# EAGLE schematic curtains (EAGLE 9.6.2)
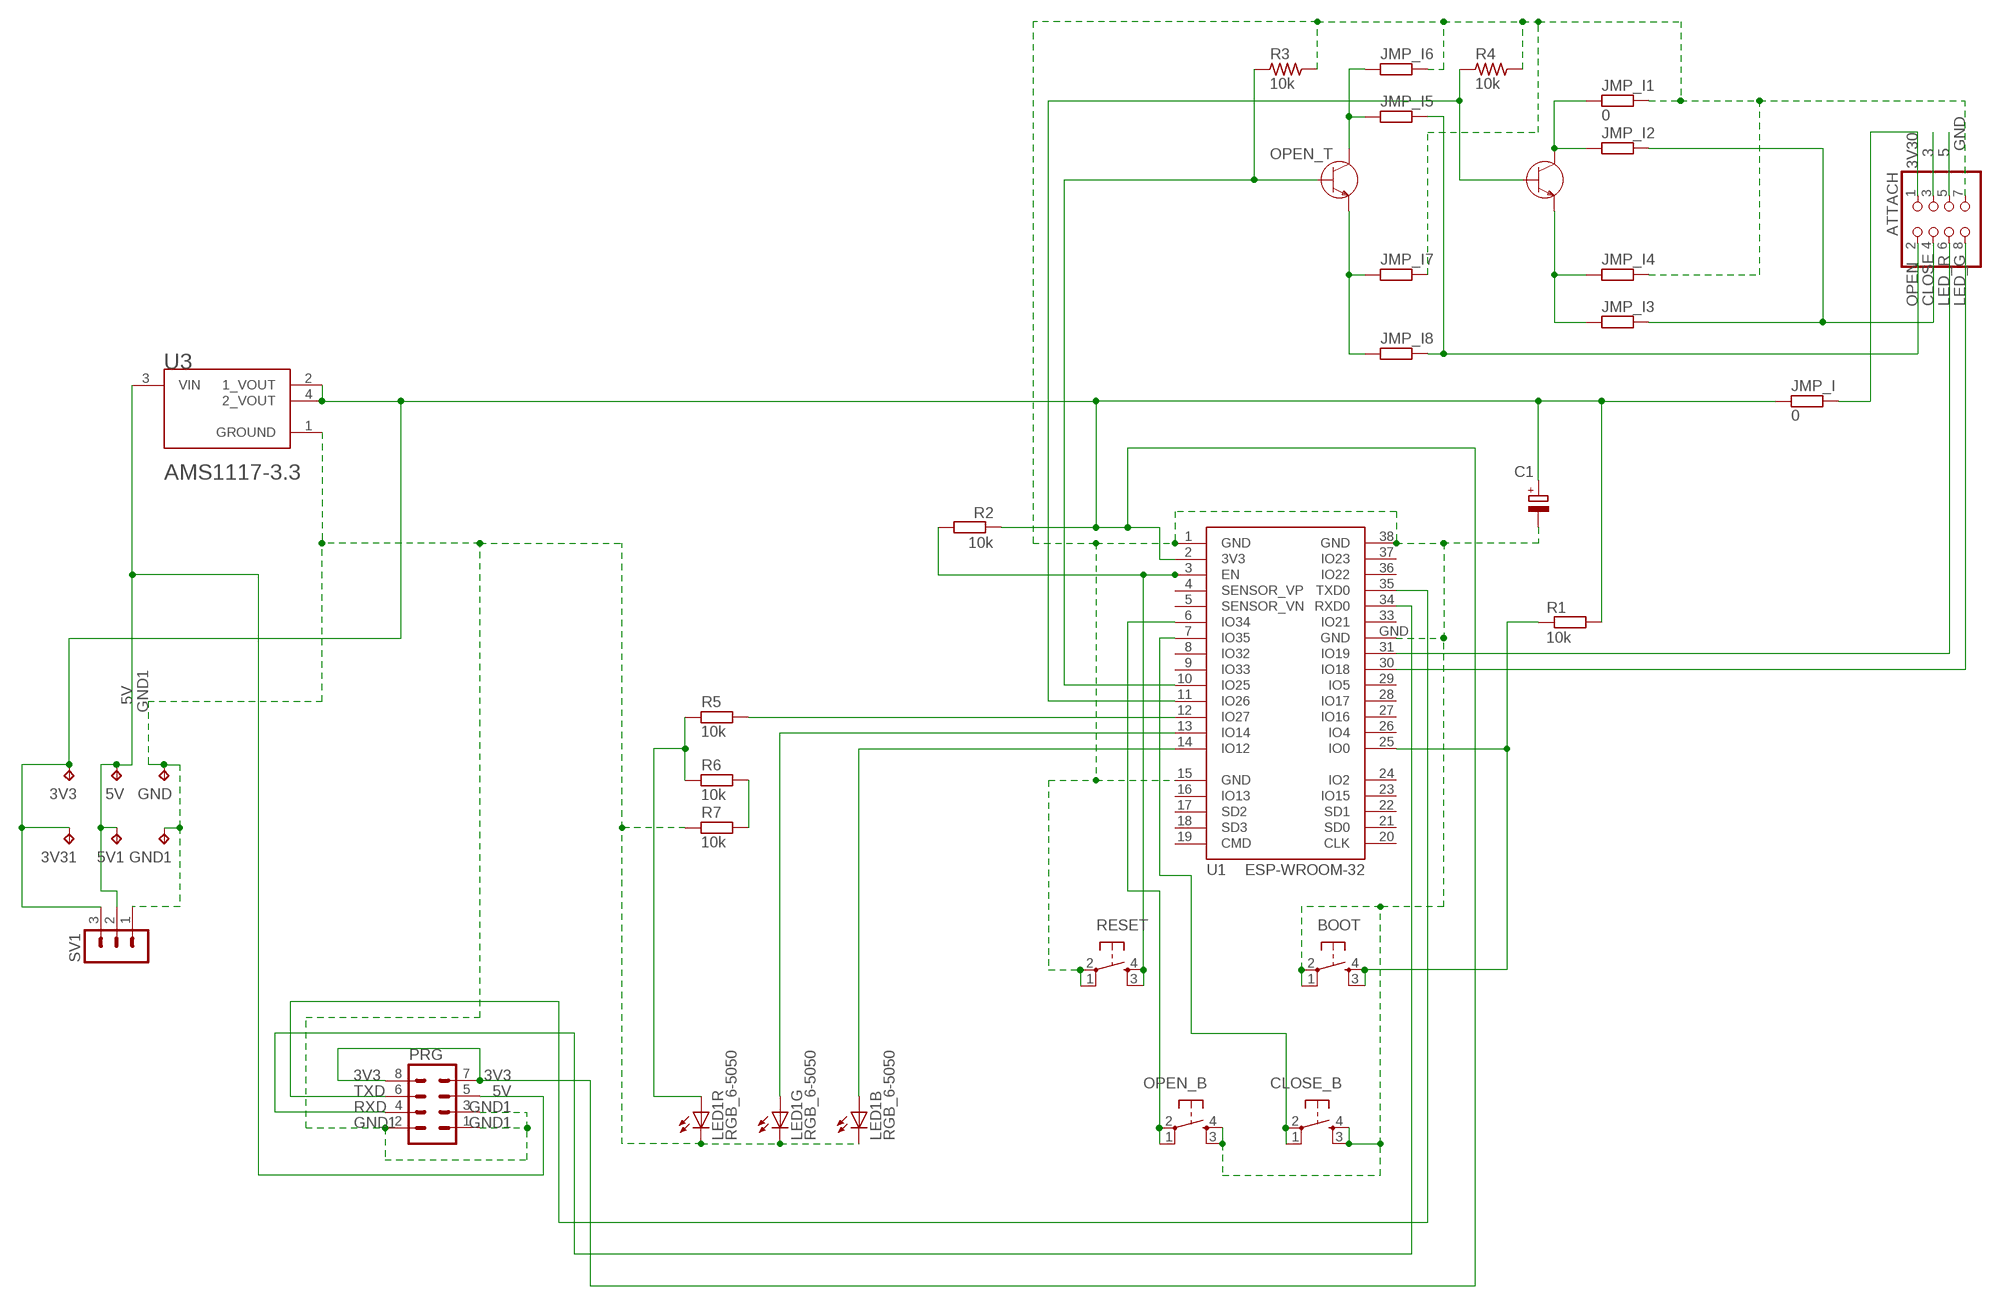
[diagram p0: schematic, sheet 1]

## Parts
3V3  TPB1,27  [B1,27]
3V31  TPB1,27  [B1,27]
5V  TPB1,27  [B1,27]
5V1  TPB1,27  [B1,27]
ATTACH  PINHD-2X4  [2X04]
BOOT  10-XX4X4SMD  [BT4X4]
C1  CPOL-EU153CLV-0505  [153CLV-0505]
CLOSE_B  10-XX4X4SMD  [BT4X4]
CLOSE_T  MMBT2222  [SOT23]
GND  TPB1,27  [B1,27]
GND1  TPB1,27  [B1,27]
JMP_I  0  R_0603  [R0603]
JMP_I1  0  R_0603  [R0603]
JMP_I2  R_0603  [R0603]
JMP_I3  R_0603  [R0603]
JMP_I4  R_0603  [R0603]
JMP_I5  R_0603  [R0603]
JMP_I6  R_0603  [R0603]
JMP_I7  R_0603  [R0603]
JMP_I8  R_0603  [R0603]
LED1  RGB_6-5050  [5050_PLCC6]
OPEN_B  10-XX4X4SMD  [BT4X4]
OPEN_T  MMBT2222  [SOT23]
PRG  MA04-2  [MA04-2]
R1  10k  R-EU_R0603  [R0603]
R2  10k  R-EU_R0603  [R0603]
R3  10k  RC-MASTER-SMD_R_0603MP  [RC-MASTER-SMD_R0603MP]
R4  10k  RC-MASTER-SMD_R_0603MP  [RC-MASTER-SMD_R0603MP]
R5  10k  R_0603  [R0603]
R6  10k  R_0603  [R0603]
R7  10k  R_0603  [R0603]
RESET  10-XX4X4SMD  [BT4X4]
SV1  MA03-1  [MA03-1]
U1  ESP-WROOM-32  [ESP-WROOM-32]
U3  ADVANCED_MONOLITHIC_SYSTEMS_AMS1117-3.3ADVANCED_MONOLITHIC_SYSTEMS_AMS1117-3.3_0_0  [ADVANCED_MONOLITHIC_SYSTEMS_AMS1117-3.3_0]

## Nets
3: ATTACH.3
3V3: 3V3.TP 3V31.TP C1.+ JMP_I.1 PRG.7 PRG.8 R1.2 R2.1 SV1.3 U1.2(3V3) U3.2(1_VOUT) U3.4(2_VOUT)
3V30: ATTACH.1 JMP_I.2
5: ATTACH.5
5V: 5V1.TP 5V.TP PRG.5 SV1.2 U3.3(VIN)
CLOSE: ATTACH.4 JMP_I2.2 JMP_I3.2
GND: ATTACH.7 BOOT.1 BOOT.2(P) C1.- CLOSE_B.3(S1) CLOSE_B.4(S) JMP_I1.2 JMP_I4.2 JMP_I6.2 JMP_I7.2 OPEN_B.3(S1) OPEN_B.4(S) R3.2 R4.2 RESET.1 RESET.2(P) U1.1(GND) U1.15(GND) U1.38(GND) U1.GND
GND1: GND1.TP GND.TP LED1.4(B:C) LED1.5(G:C) LED1.6(R:C) PRG.1 PRG.2 PRG.3 R7.1 SV1.1 U3.1(GROUND)
LED_G: ATTACH.8 U1.30(IO18)
LED_R: ATTACH.6 U1.31(IO19)
N$1: BOOT.3(S1) BOOT.4(S) R1.1 U1.25(IO0)
N$2: OPEN_B.1 OPEN_B.2(P) U1.6(IO34)
N$3: R2.2 RESET.3(S1) RESET.4(S) U1.3(EN)
N$4: OPEN_T.1(B) R3.1 U1.10(IO25)
N$5: CLOSE_T.1(B) R4.1 U1.11(IO26)
N$6: R5.2 U1.12(IO27)
N$7: LED1.2(G:A) U1.13(IO14)
N$8: LED1.3(B:A) U1.14(IO12)
N$9: R6.2 R7.2
N$10: CLOSE_B.1 CLOSE_B.2(P) U1.7(IO35)
N$11: LED1.1(R:A) R5.1 R6.1
N$13: CLOSE_T.3(C) JMP_I1.1 JMP_I2.1
N$14: CLOSE_T.2(E) JMP_I3.1 JMP_I4.1
N$15: JMP_I7.1 JMP_I8.1 OPEN_T.2(E)
N$17: JMP_I5.1 JMP_I6.1 OPEN_T.3(C)
OPEN: ATTACH.2 JMP_I5.2 JMP_I8.2
RXD: PRG.4 U1.34(RXD0)
TXD: PRG.6 U1.35(TXD0)
Unconnected: U1.4(SENSOR_VP) U1.5(SENSOR_VN) U1.8(IO32) U1.9(IO33) U1.16(IO13) U1.17(SD2) U1.18(SD3) U1.19(CMD) U1.20(CLK) U1.21(SD0) U1.22(SD1) U1.23(IO15) U1.24(IO2) U1.26(IO4) U1.27(IO16) U1.28(IO17) U1.29(IO5) U1.33(IO21) U1.36(IO22) U1.37(IO23)

## Library data of the parts
3V3 3V31 5V 5V1 GND GND1 = testpad:TP: Test pad
ATTACH = adafruit:PINHD-2X4: PIN HEADER
BOOT CLOSE_B OPEN_B RESET = buttons:10-XX: OMRON SWITCH
C1 = rcl:CPOL-EU: POLARIZED CAPACITOR, European symbol; SPICEPREFIX: C
CLOSE_T OPEN_T = semiconductor:MMBT2222: General Purpose Transistors, NPN Silicon Rating MMBT2222LT1G MMBT2222ALT1G Collector-Emitter Voltage (VCEO) 30 Vdc 40 Vdc Collector-Base Voltage (VCBO) 60 Vdc 75 Vdc Emitter-Base Voltage (VEBO) 5.0 Vdc 6.0 Vdc Collector Current Continuous (IC) 600 mAdc 1100 mAdc Collector Current Peak (ICM) 600 mAdc 1100 mAdc
JMP_I JMP_I1-JMP_I8 R5-R7 = rc-master:R_: RESISTOR
LED1 = led:RGB_6: RGB LED 6000mcd http://tuxotronic.org/mirror/led_rgb/
PRG = con-lstb:MA04-2: PIN HEADER; OC_FARNELL: unknown; OC_NEWARK: unknown
R1 = resistor:R-EU_: RESISTOR, European symbol
R2 = resistor:R-EU_: RESISTOR, European symbol; RESISTANCE: 10K
R3 R4 = 52101-101-REV-A_v16:RC-MASTER-SMD_R_: RESISTOR
SV1 = con-lstb:MA03-1: PIN HEADER; OC_FARNELL: unknown; OC_NEWARK: unknown
U1 = esp32:ESP-WROOM-32: Espressif Systems ESP-WROOM-32
U3 = Advanced Monolithic Systems - AMS1117-3.3:ADVANCED_MONOLITHIC_SYSTEMS_AMS1117-3.3: LDO Voltage Regulators 1A, 3.3V; AUTOMOTIVE: No; CENTROID_NOT_SPECIFIED: No; DATASHEET: http://www.advanced-monolithic.com/pdf/ds1117.pdf; DEVICE_CLASS_L1: Integrated Circuits (ICs); DEVICE_CLASS_L2: Power Management ICs; DEVICE_CLASS_L3: Voltage Regulators - Linear; DROPOUT_VOLTAGE: 1.1V; FOOTPRINT_PARAMETERS_0: {"fp_type":"SOT223","params":{"N":{"default":"4","long name":"Number of leads","type":"multichoice","short name":"N"},"A":{"nom":false,"long name":"Height","min":false,"max":1800000,"short name":"A","type":"measurement"},"A1":{"nom":false,"long name":"Standoff height","min":640000,"max":840000,"short name":"A1","type":"measurement"},"A2":{"nom":false,"long name":"Package height","min":1160000,"max":false,"short name":"A2","type":"measurement"},"D":{"nom":false,"long name":"Package length","min":6300000,"max":6710000,"short name":"D","type":"measurement"},"E":{"nom":false,"long name":"Width /w leads","min":6710000,"max":7290000,"short name":"E","type":"measurement"},"E1":{"nom":false,"long name":"Package width","min":3300000,"max":3710000,"short name":"E1","type":"measurement"},"B":{"nom":false,"long name":"Lead width","min":640000,"max":840000,"short name":"B","type":"measurement"},"B2":{"nom":false,"long name":"Thermal lead width","min":2950000,"max":3150000,"short name":"B2","type":"measurement"},"C":{"nom":false,"long name":"Lead thickness","min":250000,"max":360000,"short name":"C","type":"measurement"},"L":{"nom":false,"long name":"Lead foot length","min":310000,"max":false,"short name":"L","type":"measurement"},"e":{"nom":2290000,"long name":"Lead pitch","min":null,"max":null,"short name":"e","type":"measurement"},"PHI":{"nom":false,"long name":"Lead angle","min":false,"max":10000000,"short name":"PHI","type":"measurement"},"offset x":{"nom":0,"long name":"X Center offset","min":null,"max":null,"short name":"offset x","type":"measurement"},"offset y":{"nom":0,"long name":"Y Center offset","min":null,"max":null,"short name":"offset y","type":"measurement"},"LS":{"default":"Rounded rectangle","long name":"Land shape","type":"multichoice","short name":"LS"},"LS1":{"default":"Rectangle","long name":"Land shape (Pin 1)","type":"multichoice","short name":"LS1"},"solder toe":{"nom":550000,"long name":"Solder fillet (toe)","min":null,"max":null,"short name":"solder toe","type":"fixedmeasurement"},"solder heel":{"nom":450000,"long name":"Solder fillet (heel)","min":null,"max":null,"short name":"solder heel","type":"fixedmeasurement"},"solder side":{"nom":50000,"long name":"Solder fillet (side)","min":null,"max":null,"short name":"solder side","type":"fixedmeasurement"},"courtyard":{"nom":500000,"long name":"Courtyard","min":null,"max":null,"short name":"courtyard","type":"fixedmeasurement"},"SF":{"default":"A","long name":"Packing level","type":"multichoiceparent","short name":"SF","help":"http://support.upverter.com/customer/portal/articles/978783-what-is-a-footprint-packing-level","children":["solder toe","solder heel","solder side","courtyard"]}}}; FOOTPRINT_PARAMETERS_1: {"fp_type":"SOT223","params":{"N":{"default":"4","long name":"Number of leads","type":"multichoice","short name":"N"},"A":{"nom":false,"long name":"Height","min":false,"max":1800000,"short name":"A","type":"measurement"},"A1":{"nom":false,"long name":"Standoff height","min":640000,"max":840000,"short name":"A1","type":"measurement"},"A2":{"nom":false,"long name":"Package height","min":1160000,"max":false,"short name":"A2","type":"measurement"},"D":{"nom":false,"long name":"Package length","min":6300000,"max":6710000,"short name":"D","type":"measurement"},"E":{"nom":false,"long name":"Width /w leads","min":6710000,"max":7290000,"short name":"E","type":"measurement"},"E1":{"nom":false,"long name":"Package width","min":3300000,"max":3710000,"short name":"E1","type":"measurement"},"B":{"nom":false,"long name":"Lead width","min":640000,"max":840000,"short name":"B","type":"measurement"},"B2":{"nom":false,"long name":"Thermal lead width","min":2950000,"max":3150000,"short name":"B2","type":"measurement"},"C":{"nom":false,"long name":"Lead thickness","min":250000,"max":360000,"short name":"C","type":"measurement"},"L":{"nom":false,"long name":"Lead foot length","min":310000,"max":false,"short name":"L","type":"measurement"},"e":{"nom":2290000,"long name":"Lead pitch","min":null,"max":null,"short name":"e","type":"measurement"},"PHI":{"nom":false,"long name":"Lead angle","min":false,"max":10000000,"short name":"PHI","type":"measurement"},"offset x":{"nom":0,"long name":"X Center offset","min":null,"max":null,"short name":"offset x","type":"measurement"},"offset y":{"nom":0,"long name":"Y Center offset","min":null,"max":null,"short name":"offset y","type":"measurement"},"LS":{"default":"Rounded rectangle","long name":"Land shape","type":"multichoice","short name":"LS"},"LS1":{"default":"Rectangle","long name":"Land shape (Pin 1)","type":"multichoice","short name":"LS1"},"solder toe":{"nom":350000,"long name":"Solder fillet (toe)","min":null,"max":null,"short name":"solder toe","type":"fixedmeasurement"},"solder heel":{"nom":350000,"long name":"Solder fillet (heel)","min":null,"max":null,"short name":"solder heel","type":"fixedmeasurement"},"solder side":{"nom":30000,"long name":"Solder fillet (side)","min":null,"max":null,"short name":"solder side","type":"fixedmeasurement"},"courtyard":{"nom":250000,"long name":"Courtyard","min":null,"max":null,"short name":"courtyard","type":"fixedmeasurement"},"SF":{"default":"B","long name":"Packing level","type":"multichoiceparent","short name":"SF","help":"http://support.upverter.com/customer/portal/articles/978783-what-is-a-footprint-packing-level","children":["solder toe","solder heel","solder side","courtyard"]}}}; FOOTPRINT_PARAMETERS_2: {"fp_type":"SOT223","params":{"N":{"default":"4","long name":"Number of leads","type":"multichoice","short name":"N"},"A":{"nom":false,"long name":"Height","min":false,"max":1800000,"short name":"A","type":"measurement"},"A1":{"nom":false,"long name":"Standoff height","min":640000,"max":840000,"short name":"A1","type":"measurement"},"A2":{"nom":false,"long name":"Package height","min":1160000,"max":false,"short name":"A2","type":"measurement"},"D":{"nom":false,"long name":"Package length","min":6300000,"max":6710000,"short name":"D","type":"measurement"},"E":{"nom":false,"long name":"Width /w leads","min":6710000,"max":7290000,"short name":"E","type":"measurement"},"E1":{"nom":false,"long name":"Package width","min":3300000,"max":3710000,"short name":"E1","type":"measurement"},"B":{"nom":false,"long name":"Lead width","min":640000,"max":840000,"short name":"B","type":"measurement"},"B2":{"nom":false,"long name":"Thermal lead width","min":2950000,"max":3150000,"short name":"B2","type":"measurement"},"C":{"nom":false,"long name":"Lead thickness","min":250000,"max":360000,"short name":"C","type":"measurement"},"L":{"nom":false,"long name":"Lead foot length","min":310000,"max":false,"short name":"L","type":"measurement"},"e":{"nom":2290000,"long name":"Lead pitch","min":null,"max":null,"short name":"e","type":"measurement"},"PHI":{"nom":false,"long name":"Lead angle","min":false,"max":10000000,"short name":"PHI","type":"measurement"},"offset x":{"nom":0,"long name":"X Center offset","min":null,"max":null,"short name":"offset x","type":"measurement"},"offset y":{"nom":0,"long name":"Y Center offset","min":null,"max":null,"short name":"offset y","type":"measurement"},"LS":{"default":"Rounded rectangle","long name":"Land shape","type":"multichoice","short name":"LS"},"LS1":{"default":"Rectangle","long name":"Land shape (Pin 1)","type":"multichoice","short name":"LS1"},"solder toe":{"nom":150000,"long name":"Solder fillet (toe)","min":null,"max":null,"short name":"solder toe","type":"fixedmeasurement"},"solder heel":{"nom":250000,"long name":"Solder fillet (heel)","min":null,"max":null,"short name":"solder heel","type":"fixedmeasurement"},"solder side":{"nom":10000,"long name":"Solder fillet (side)","min":null,"max":null,"short name":"solder side","type":"fixedmeasurement"},"courtyard":{"nom":100000,"long name":"Courtyard","min":null,"max":null,"short name":"courtyard","type":"fixedmeasurement"},"SF":{"default":"C","long name":"Packing level","type":"multichoiceparent","short name":"SF","help":"http://support.upverter.com/customer/portal/articles/978783-what-is-a-footprint-packing-level","children":["solder toe","solder heel","solder side","courtyard"]}}}; FOOTPRINT_VARIANT_NAME_0: IPC_A; FOOTPRINT_VARIANT_NAME_1: IPC_B; FOOTPRINT_VARIANT_NAME_2: IPC_C; HEIGHT: 1.8mm; IPC_LAND_PATTERN_NAME: SOT229P700X180-4; LEAD_FREE: Yes; MAX_JUNCTION_TEMP: +125°C; MAX_POWER_DISSIPATION: 1.2W; MAX_SUPPLY_VOLTAGE: 15V; MF: Advanced Monolithic Systems; MFG_PACKAGE_IDENT: AMS1117; MFG_PACKAGE_IDENT_DATE: 0; MFG_PACKAGE_IDENT_REV: 0; MPN: AMS1117-3.3; NOMINAL_SUPPLY_CURRENT: 5mA; NUMBER_OF_OUTPUTS: 1; OUTPUT_CURRENT: 1A; OUTPUT_TYPE: Fixed; OUTPUT_VOLTAGE: 3.3V; PACKAGE: SOT223-3; PREFIX: U; ROHS: Yes; STANDOFF_HEIGHT: 0.64mm; TEMPERATURE_RANGE_HIGH: +125°C; TEMPERATURE_RANGE_LOW: -40°C; VERIFICATION_VERSION: 0.0.0.3

## Module ESP
Ports: 

### Library data of the parts